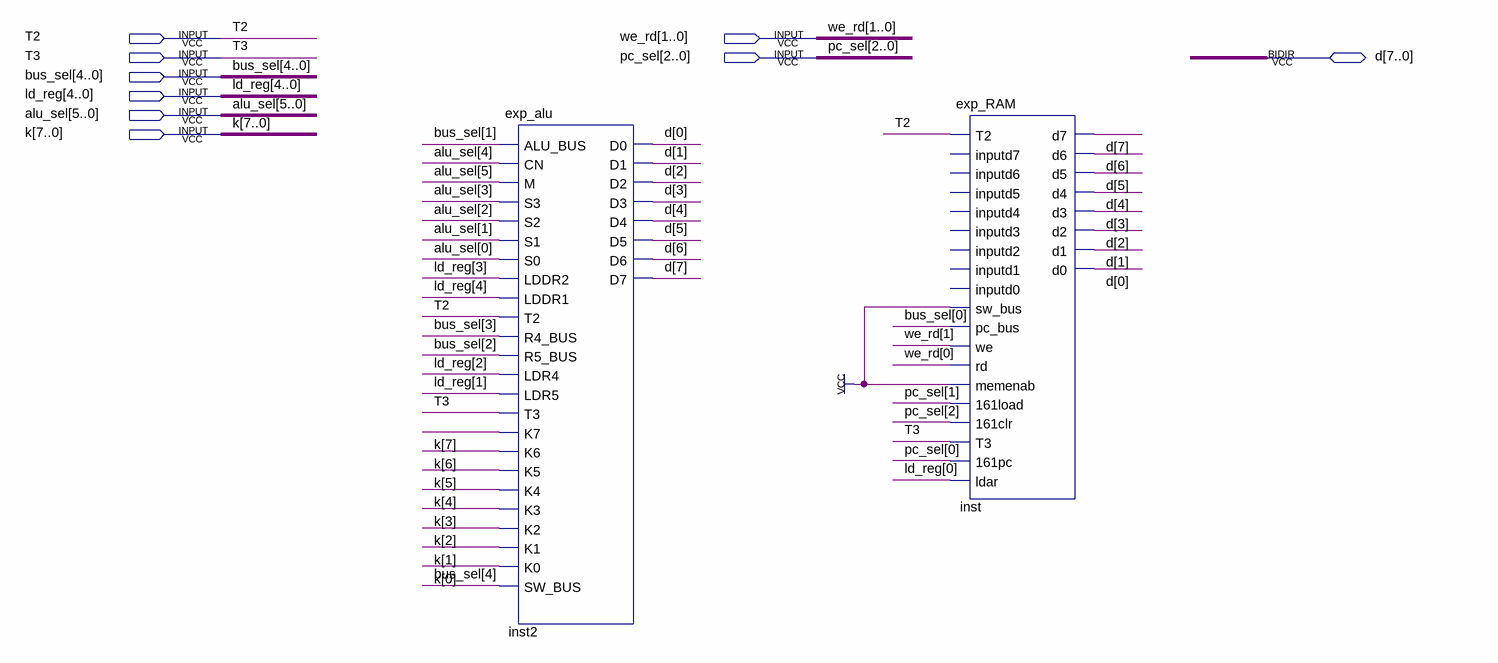
[diagram p0: schematic sheet]
// Quartus schematic datapath.bdf as structural Verilog: 2 symbols, 9 pins
module datapath (
  input  T2,
  input  [1:0] we_rd,
  input  T3,
  input  [2:0] pc_sel,
  input  [4:0] bus_sel,
  input  [4:0] ld_reg,
  input  [5:0] alu_sel,
  input  [7:0] k,
  inout  [7:0] d
);

  exp_alu inst2 (
    .ALU_BUS(bus_sel[1]), .CN(alu_sel[4]), .M(alu_sel[5]), .S3(alu_sel[3]), .S2(alu_sel[2]), .S1(alu_sel[1]),
    .S0(alu_sel[0]), .LDDR2(ld_reg[3]), .LDDR1(ld_reg[4]), .T2(T2), .R4_BUS(bus_sel[3]), .R5_BUS(bus_sel[2]),
    .LDR4(ld_reg[2]), .LDR5(ld_reg[1]), .T3(T3), .K7(k[7]), .K6(k[6]), .K5(k[5]), .K4(k[4]), .K3(k[3]),
    .K2(k[2]), .K1(k[1]), .K0(k[0]), .SW_BUS(bus_sel[4]), .D0(d[0]), .D1(d[1]), .D2(d[2]), .D3(d[3]),
    .D4(d[4]), .D5(d[5]), .D6(d[6]), .D7(d[7]));
  exp_RAM inst (
    .T2(T2), .sw_bus(1'b1), .pc_bus(bus_sel[0]), .we(we_rd[1]), .rd(we_rd[0]), .memenab(1'b1),
    .\161load (pc_sel[1]), .\161clr (pc_sel[2]), .T3(T3), .\161pc (pc_sel[0]), .ldar(ld_reg[0]), .d7(d[7]),
    .d6(d[6]), .d5(d[5]), .d4(d[4]), .d3(d[3]), .d2(d[2]), .d1(d[1]), .d0(d[0]));  // open: inputd7, inputd6, inputd5, inputd4, inputd3, inputd2, inputd1, inputd0
endmodule
